# EAGLE schematic All-in-one Starter Kit for Micro：bit V1.0 (EAGLE 9.6.2)
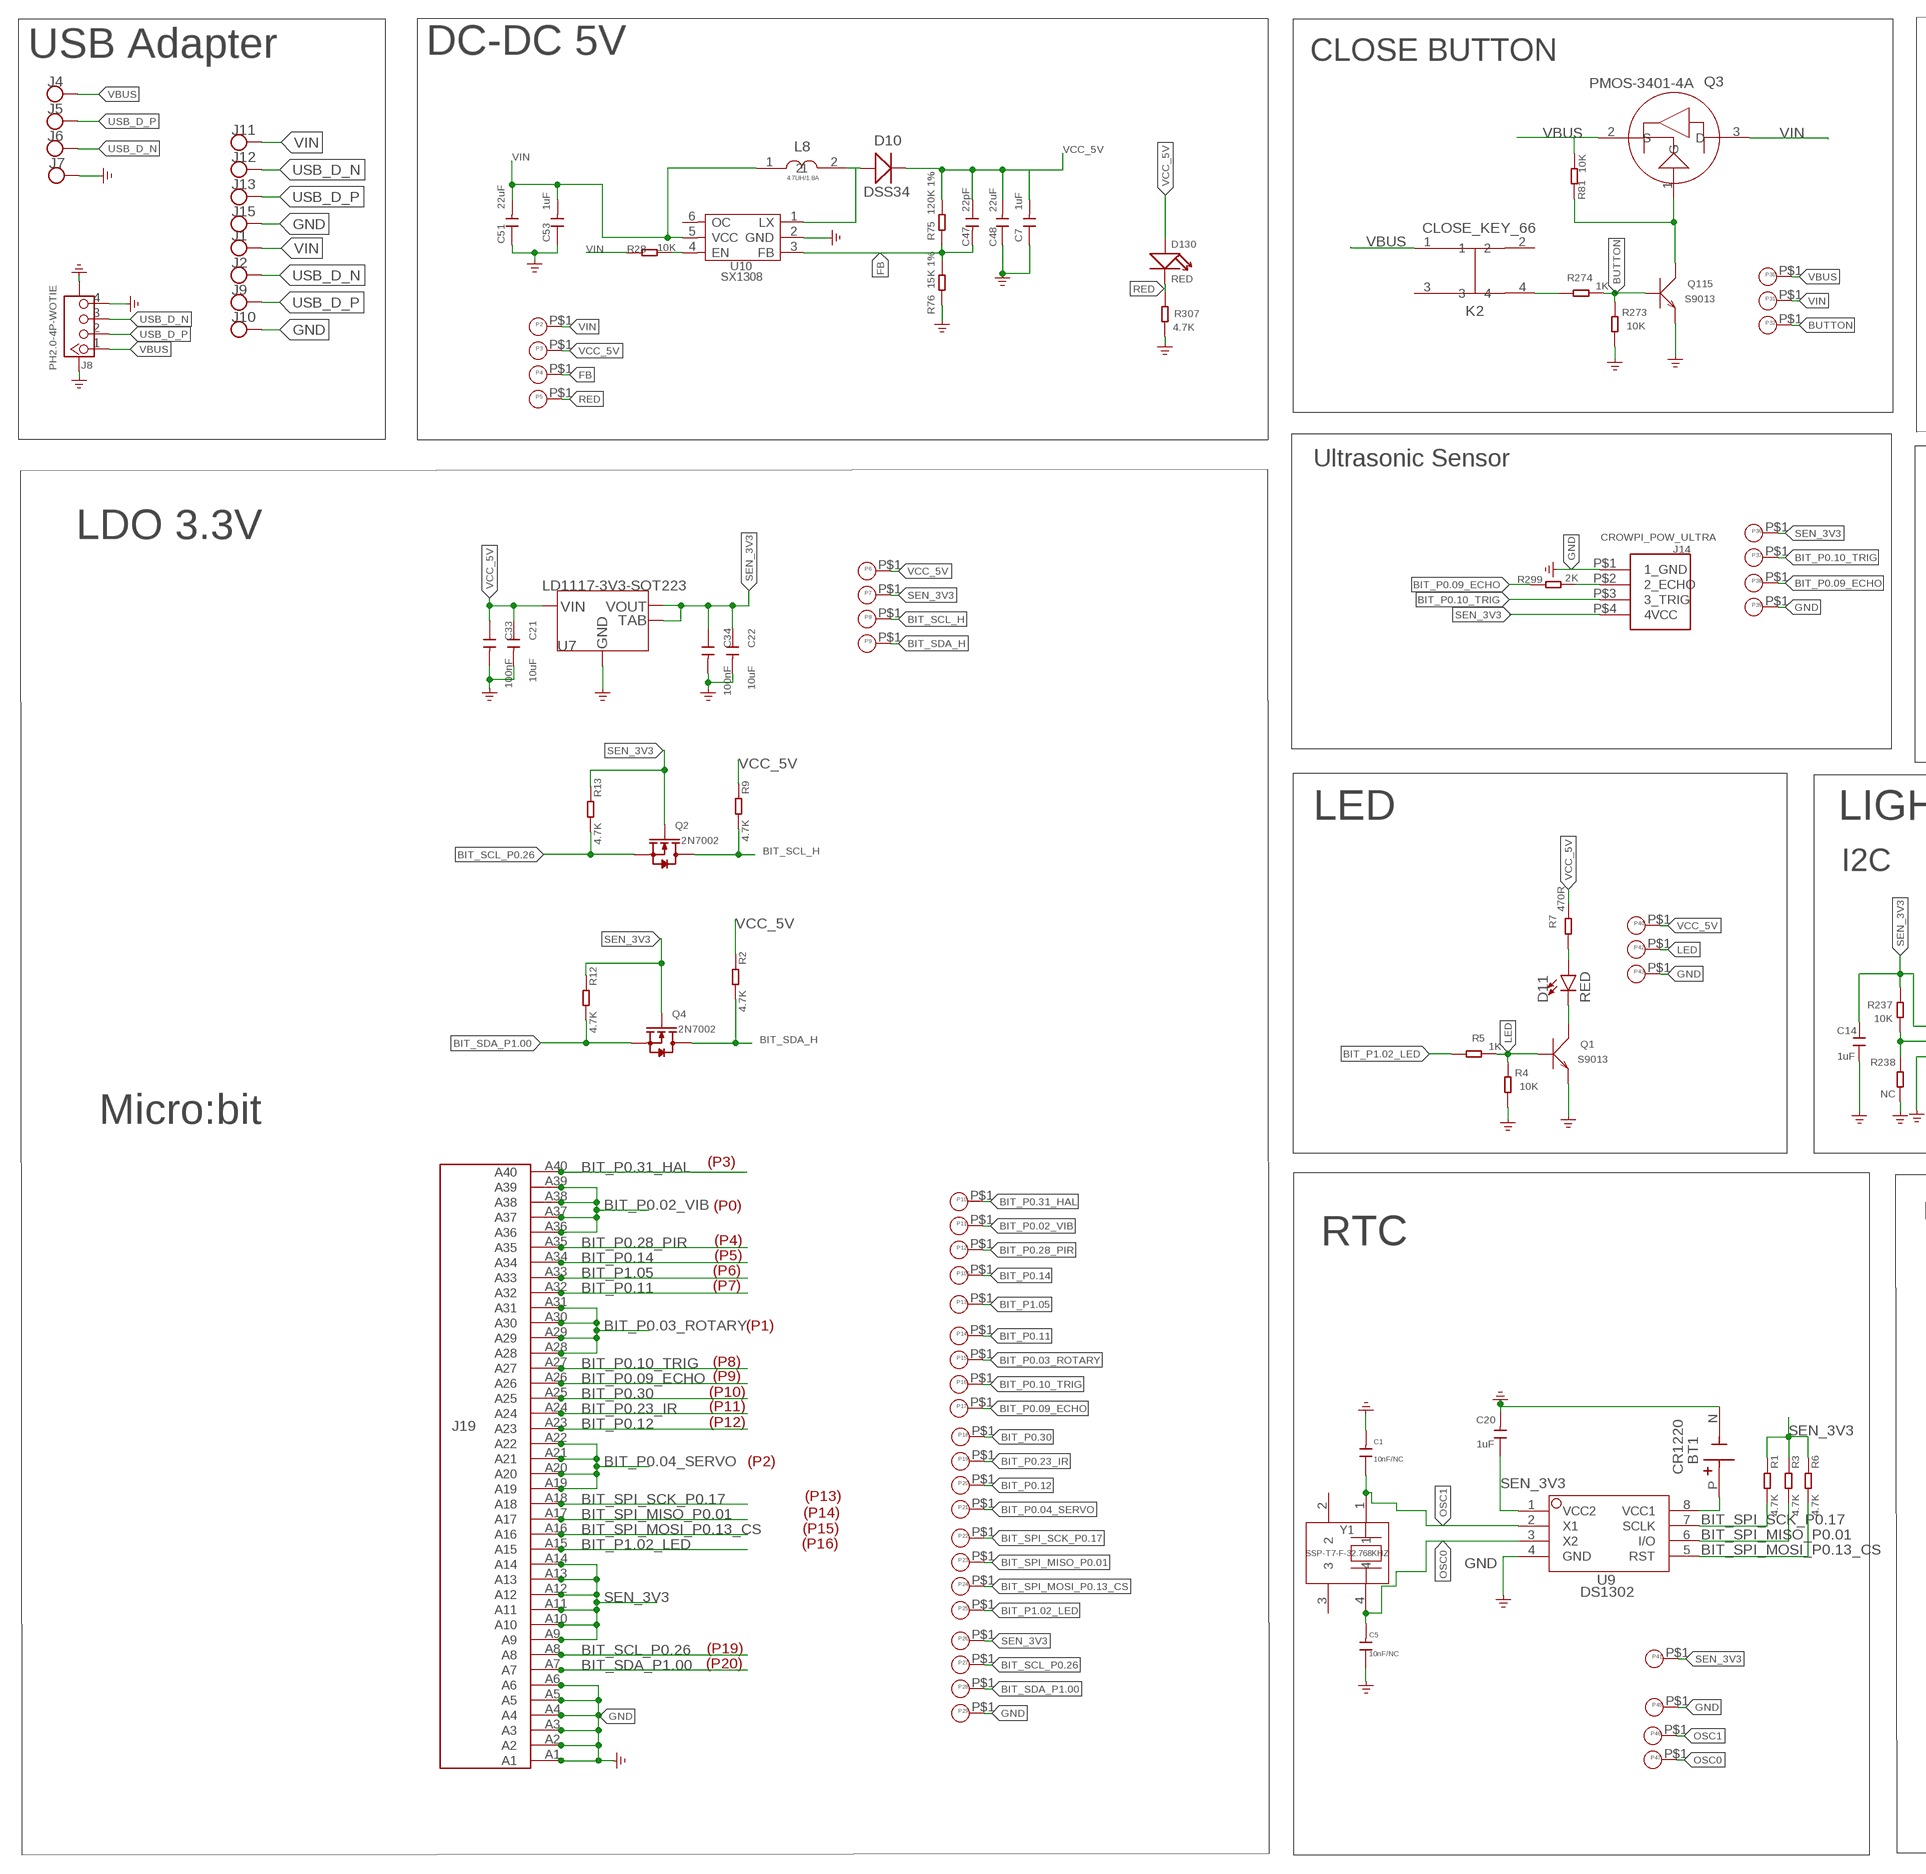
[diagram p0: schematic, sheet 1, part 1 of 2]
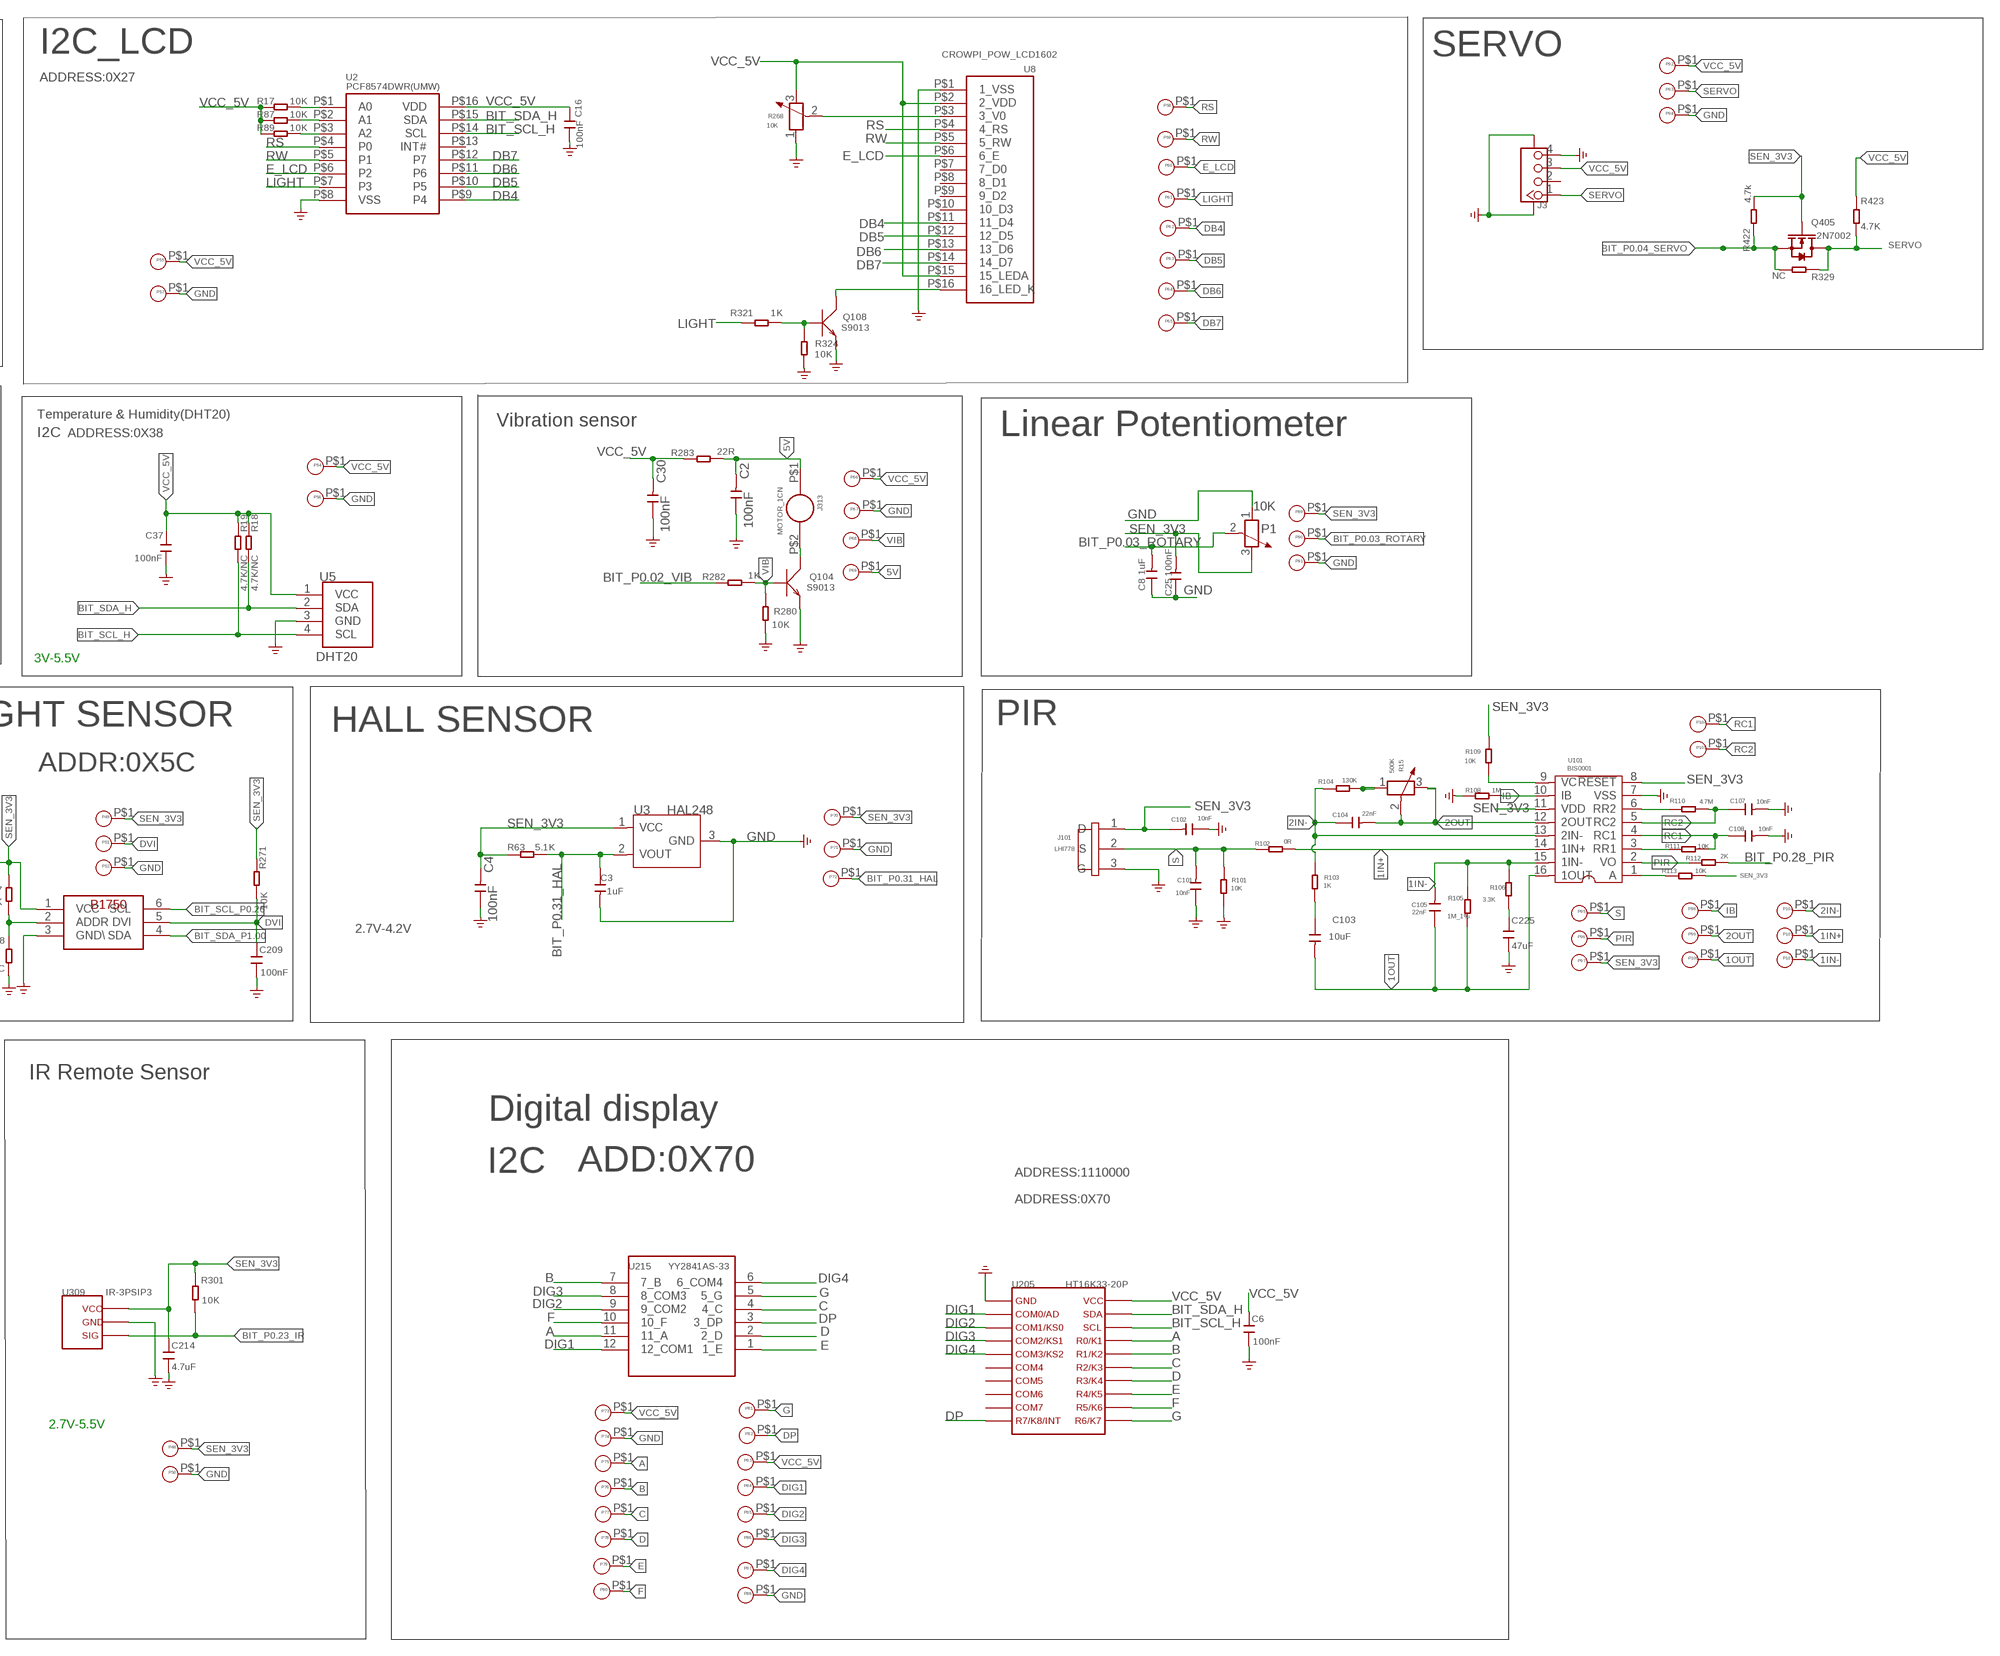
[diagram p1: schematic, sheet 1, part 2 of 2]

## Parts
BT1  CR1220  [CR1220]
C1  10nF/NC  C-0603  [C0603]
C2  100nF  C-0603  [C0603]
C3  1uF  C-0603  [C0603]
C4  100nF  C-0603  [C0603]
C5  10nF/NC  C-0603  [C0603]
C6  100nF  C0603  [0603]
C7  1uF  CAP  [C0603]
C8  1uF  C-0603  [C0603]
C14  1uF  C0603  [0603]
C16  100nF  C0603  [0603]
C20  1uF  CAP  [C0603]
C21  10uF  CAP  [C0603]
C22  10uF  CAP  [C0603]
C25  100nF  C-0603  [C0603]
C30  100nF  C-0603  [C0603]
C33  100nF  CAP  [C0603]
C34  100nF  CAP  [C0603]
C37  100nF  C0603  [0603]
C47  22pF  CAP  [C0603]
C48  22uF  CAPC0805  [C0805]
C51  22uF  CAPC0805  [C0805]
C53  1uF  CAP  [C0603]
C101  10nF  C-0603  [C0603]
C102  10nF  C-0603  [C0603]
C103  10uF  C0603  [0603]
C104  22nF  C-0603  [C0603]
C105  22nF  C-0603  [C0603]
C107  10nF  C-0603  [C0603]
C108  10nF  C-0603  [C0603]
C209  100nF  C0603  [0603]
C214  4.7uF  C0603  [0603]
C225  47uF  C0805  [0805]
D10  DSS34  DIODE  [D_SOD123FL]
D11  RED  LED  [LED-8MM]
D130  RED  LED_0603_SMT  [LED_0603_SMT]
J1  TP-SMDTP-SMD-2X4MM  [TP-SMD-2X4MM]
J2  TP-SMDTP-SMD-2X4MM  [TP-SMD-2X4MM]
J3  A_XBJ_CONNECTOR_TWIG-4P-2.0-SMD-FEMALE-REINFORCE90D  [A_XBJ_CONNECTOR_4P-SMD-2.0-90D]
J4  TP-SMDTP-SMD-2X4MM  [TP-SMD-2X4MM]
J5  TP-SMDTP-SMD-2X4MM  [TP-SMD-2X4MM]
J6  TP-SMDTP-SMD-2X4MM  [TP-SMD-2X4MM]
J7  TP-SMDTP-SMD-2X4MM  [TP-SMD-2X4MM]
J8  PH2.0-4P-WOTIE  [PH2.0-4P]
J9  TP-SMDTP-SMD-2X4MM  [TP-SMD-2X4MM]
J10  TP-SMDTP-SMD-2X4MM  [TP-SMD-2X4MM]
J11  TP-SMDTP-SMD-2X4MM  [TP-SMD-2X4MM]
J12  TP-SMDTP-SMD-2X4MM  [TP-SMD-2X4MM]
J13  TP-SMDTP-SMD-2X4MM  [TP-SMD-2X4MM]
J14  CROWPI_POW_ULTRA  [CROWPI_POW_ULTRA]
J15  TP-SMDTP-SMD-2X4MM  [TP-SMD-2X4MM]
J19  MICROBIT_SMD_40P  [MICROBIT_SMD_40P]
J101  LHI778  [3P-D8.1MM]
J313  MOTOR_1CN  [MOTOR_1CM]
K2  CLOSE_KEY_66  [CLOSE_KEY_6*6]
L8  4.7UH/1.8A  ZEMS252012-4R7M  [1008]
P1  10K  R-POTENTIOMETER  [3P-SQUA-45.6X10X5.8H]
P2  PADPAD-1.0MM  [PAD-1.0MM]
P3  PADPAD-1.0MM  [PAD-1.0MM]
P4  PADPAD-1.0MM  [PAD-1.0MM]
P5  PADPAD-1.0MM  [PAD-1.0MM]
P6  PADPAD-1.0MM  [PAD-1.0MM]
P7  PADPAD-1.0MM  [PAD-1.0MM]
P8  PADPAD-1.0MM  [PAD-1.0MM]
P9  PADPAD-1.0MM  [PAD-1.0MM]
P10  PADPAD-1.0MM  [PAD-1.0MM]
P11  PADPAD-1.0MM  [PAD-1.0MM]
P12  PADPAD-1.0MM  [PAD-1.0MM]
P13  PADPAD-1.0MM  [PAD-1.0MM]
P14  PADPAD-1.0MM  [PAD-1.0MM]
P15  PADPAD-1.0MM  [PAD-1.0MM]
P16  PADPAD-1.0MM  [PAD-1.0MM]
P17  PADPAD-1.0MM  [PAD-1.0MM]
P18  PADPAD-1.0MM  [PAD-1.0MM]
P19  PADPAD-1.0MM  [PAD-1.0MM]
P20  PADPAD-1.0MM  [PAD-1.0MM]
P21  PADPAD-1.0MM  [PAD-1.0MM]
P22  PADPAD-1.0MM  [PAD-1.0MM]
P23  PADPAD-1.0MM  [PAD-1.0MM]
P24  PADPAD-1.0MM  [PAD-1.0MM]
P25  PADPAD-1.0MM  [PAD-1.0MM]
P26  PADPAD-1.0MM  [PAD-1.0MM]
P27  PADPAD-1.0MM  [PAD-1.0MM]
P28  PADPAD-1.0MM  [PAD-1.0MM]
P29  PADPAD-1.0MM  [PAD-1.0MM]
P30  PADPAD-1.0MM  [PAD-1.0MM]
P31  PADPAD-1.0MM  [PAD-1.0MM]
P32  PADPAD-1.0MM  [PAD-1.0MM]
P36  PADPAD-1.0MM  [PAD-1.0MM]
P37  PADPAD-1.0MM  [PAD-1.0MM]
P38  PADPAD-1.0MM  [PAD-1.0MM]
P39  PADPAD-1.0MM  [PAD-1.0MM]
P40  PADPAD-1.0MM  [PAD-1.0MM]
P41  PADPAD-1.0MM  [PAD-1.0MM]
P42  PADPAD-1.0MM  [PAD-1.0MM]
P43  PADPAD-1.0MM  [PAD-1.0MM]
P45  PADPAD-1.0MM  [PAD-1.0MM]
P46  PADPAD-1.0MM  [PAD-1.0MM]
P47  PADPAD-1.0MM  [PAD-1.0MM]
P48  PADPAD-1.0MM  [PAD-1.0MM]
P49  PADPAD-1.0MM  [PAD-1.0MM]
P50  PADPAD-1.0MM  [PAD-1.0MM]
P51  PADPAD-1.0MM  [PAD-1.0MM]
P52  PADPAD-1.0MM  [PAD-1.0MM]
P54  PADPAD-1.0MM  [PAD-1.0MM]
P55  PADPAD-1.0MM  [PAD-1.0MM]
P56  PADPAD-1.0MM  [PAD-1.0MM]
P57  PADPAD-1.0MM  [PAD-1.0MM]
P58  PADPAD-1.0MM  [PAD-1.0MM]
P59  PADPAD-1.0MM  [PAD-1.0MM]
P60  PADPAD-1.0MM  [PAD-1.0MM]
P61  PADPAD-1.0MM  [PAD-1.0MM]
P62  PADPAD-1.0MM  [PAD-1.0MM]
P63  PADPAD-1.0MM  [PAD-1.0MM]
P64  PADPAD-1.0MM  [PAD-1.0MM]
P65  PADPAD-1.0MM  [PAD-1.0MM]
P66  PADPAD-1.0MM  [PAD-1.0MM]
P67  PADPAD-1.0MM  [PAD-1.0MM]
P68  PADPAD-1.0MM  [PAD-1.0MM]
P69  PADPAD-1.0MM  [PAD-1.0MM]
P70  PADPAD-1.0MM  [PAD-1.0MM]
P71  PADPAD-1.0MM  [PAD-1.0MM]
P72  PADPAD-1.0MM  [PAD-1.0MM]
P73  PADPAD-1.0MM  [PAD-1.0MM]
P74  PADPAD-1.0MM  [PAD-1.0MM]
P75  PADPAD-1.0MM  [PAD-1.0MM]
P76  PADPAD-1.0MM  [PAD-1.0MM]
P77  PADPAD-1.0MM  [PAD-1.0MM]
P78  PADPAD-1.0MM  [PAD-1.0MM]
P79  PADPAD-1.0MM  [PAD-1.0MM]
P80  PADPAD-1.0MM  [PAD-1.0MM]
P81  PADPAD-1.0MM  [PAD-1.0MM]
P82  PADPAD-1.0MM  [PAD-1.0MM]
P83  PADPAD-1.0MM  [PAD-1.0MM]
P84  PADPAD-1.0MM  [PAD-1.0MM]
P85  PADPAD-1.0MM  [PAD-1.0MM]
P86  PADPAD-1.0MM  [PAD-1.0MM]
P87  PADPAD-1.0MM  [PAD-1.0MM]
P88  PADPAD-1.0MM  [PAD-1.0MM]
P89  PADPAD-1.0MM  [PAD-1.0MM]
P90  PADPAD-1.0MM  [PAD-1.0MM]
P91  PADPAD-1.0MM  [PAD-1.0MM]
P92  PADPAD-1.0MM  [PAD-1.0MM]
P93  PADPAD-1.0MM  [PAD-1.0MM]
P94  PADPAD-1.0MM  [PAD-1.0MM]
P95  PADPAD-1.0MM  [PAD-1.0MM]
P96  PADPAD-1.0MM  [PAD-1.0MM]
P97  PADPAD-1.0MM  [PAD-1.0MM]
P98  PADPAD-1.0MM  [PAD-1.0MM]
P99  PADPAD-1.0MM  [PAD-1.0MM]
P100  PADPAD-1.0MM  [PAD-1.0MM]
P101  PADPAD-1.0MM  [PAD-1.0MM]
P102  PADPAD-1.0MM  [PAD-1.0MM]
P103  PADPAD-1.0MM  [PAD-1.0MM]
P104  PADPAD-1.0MM  [PAD-1.0MM]
P105  PADPAD-1.0MM  [PAD-1.0MM]
P106  PADPAD-1.0MM  [PAD-1.0MM]
Q1  S9013  TRANSISTOR-NPN-SOT23  [SOT23@1]
Q2  2N7002  MOSFET-N'SOT23'  [SOT23]
Q3  PMOS-3401-4A  DFN8_P-MOS-SOT23  [DFN8_SOT-23]
Q4  2N7002  MOSFET-N'SOT23'  [SOT23]
Q104  S9013  TRANSISTOR-NPN-SOT23  [SOT23@1]
Q108  S9013  TRANSISTOR-NPN-SOT23  [SOT23@1]
Q115  S9013  TRANSISTOR-NPN-SOT23  [SOT23@1]
Q405  2N7002  MOSFET-N'SOT23'  [SOT23]
R1  4.7K  R0603  [R0603]
R2  4.7K  R0603  [R0603]
R3  4.7K  R0603  [R0603]
R4  10K  R-0603  [R0603]
R5  1K  R-0603  [R0603]
R6  4.7K  R0603  [R0603]
R7  470R  R-0603  [R0603]
R9  4.7K  R0603  [R0603]
R12  4.7K  R0603  [R0603]
R13  4.7K  R0603  [R0603]
R15  500K  R-POTENTIOMETER-SMD  [3P-SMD-SQUA-3.6X3.3]
R17  10K  R0603  [R0603]
R18  4.7K/NC  R0603  [R0603]
R19  4.7K/NC  R0603  [R0603]
R28  10K  RES-0603  [R0603-SP]
R63  5.1K  R-0603  [R0603]
R75  120K 1%  RES-0603  [R0603-SP]
R76  15K 1%  RES-0603  [R0603-SP]
R81  10K  DISCRETE_R-0603  [DISCRETE_R0603]
R87  10K  R0603  [R0603]
R89  10K  R0603  [R0603]
R101  10K  R-0603  [R0603]
R102  0R  R-0603  [R0603]
R103  1K  R-0603  [R0603]
R104  130K  R-0603  [R0603]
R105  1M_1%  R-0603  [R0603]
R106  3.3K  R-0603  [R0603]
R108  1M  R-0603  [R0603]
R109  10K  R-0603  [R0603]
R110  4.7M  R-0603  [R0603]
R111  10K  R-0603  [R0603]
R112  2K  R-0603  [R0603]
R113  10K  R-0603  [R0603]
R237  10K  R0603  [R0603]
R238  NC  R0603  [R0603]
R268  10K  R-POTENTIOMETER-SMD  [3P-SMD-SQUA-3.6X3.3]
R271  10K  R0603  [R0603]
R273  10K  R-0603  [R0603]
R274  1K  R-0603  [R0603]
R280  10K  R0603  [R0603]
R282  1K  R0603  [R0603]
R283  22R  R0603  [R0603]
R299  2K  R0603  [R0603]
R301  10K  R0603  [R0603]
R307  4.7K  R0603  [R0603]
R321  1K  R0603  [R0603]
R324  10K  R0603  [R0603]
R329  NC  RESR0603  [R0603]
R422  4.7k  RESR0603  [R0603]
R423  4.7K  RESR0603  [R0603]
U1  BH1750  [BH1750-WSOF-6]
U2  PCF8574DWR(UMW)  PCF8574T/TR  [SO-16-300MIL]
U3  HAL248  A1101  [SOT-23W]
U5  DHT20  CROWTAIL-DHT20-V1.0-20211013_DHT20  [CROWTAIL-DHT20-V1.0-20211013_DHT20]
U7  LD1117-3V3-SOT223  [SOT223]
U8  CROWPI_POW_LCD1602  [CROWPI_POW_LCD1206]
U9  DS1302  [SOP8]
U10  SX1308  STUDY_SX1301  [SOT23-6L]
U101  BIS0001  TM2291  [SOP16]
U205  HT16K33-20P  [HT16K33-SOP20]
U215  YY2841AS-33  4-DIGITAL_DISPLAY  [4-DIGITAL_DISPLAY]
U309  IR-3PSIP3  [VS1838B-SIP3]
Y1  SSP-T7-F-32.768KHZ  [MC-146]

## Nets
1IN+: P102.P$1 R102.1 U101.14(1IN+)
1IN-: C105.2 P103.P$1 R105.2 R106.2 U101.15(1IN-)
1OUT: C103.2 C105.1 P100.P$1 R105.1 U101.16(1OUT)
2IN-: C104.1 P101.P$1 R103.2 R104.2 U101.13(2IN-)
2OUT: C104.2 P99.P$1 R15.2 R15.3 U101.12(2OUT)
5V: C2.2 J313.P$1 P69.P$1 R283.2
A: P75.P$1 U205.P$17 U215.11(11_A)
B: P76.P$1 U205.P$16 U215.7(7_B)
BIT_P0.02_VIB: J19.A36 J19.A37 J19.A38 J19.A39 P11.P$1 R282.1
BIT_P0.03_ROTARY: C8.2 J19.A28 J19.A29 J19.A30 J19.A31 P1.2 P15.P$1 P90.P$1
BIT_P0.04_SERVO: J19.A19 J19.A20 J19.A21 J19.A22 P21.P$1 Q405.2(S) R329.2 R422.1
BIT_P0.09_ECHO: J19.A26 P17.P$1 P38.P$1 R299.2
BIT_P0.10_TRIG: J14.P$3(3_TRIG) J19.A27 P16.P$1 P37.P$1
BIT_P0.11: J19.A32 P14.P$1
BIT_P0.12: J19.A23 P20.P$1
BIT_P0.14: J19.A34 P106.P$1
BIT_P0.23_IR: J19.A24 P19.P$1 R301.2 U309.3
BIT_P0.28_PIR: J19.A35 P12.P$1 R112.1
BIT_P0.30: J19.A25 P18.P$1
BIT_P0.31_HAL: C3.1 J19.A40 P10.P$1 P72.P$1 R63.1 U3.2(VOUT)
BIT_P1.02_LED: J19.A15 P25.P$1 R5.2
BIT_P1.05: J19.A33 P13.P$1
BIT_SCL_H: P8.P$1 Q2.3(D) R9.2 R19.2 U2.P$14(SCL) U5.4(SCL) U205.P$18
BIT_SCL_P0.26: J19.A8 P27.P$1 Q2.2(S) R13.2 U1.6(SCL)
BIT_SDA_H: P9.P$1 Q4.3(D) R2.2 R18.2 U2.P$15(SDA) U5.2(SDA) U205.P$19
BIT_SDA_P1.00: J19.A7 P28.P$1 Q4.2(S) R12.2 U1.4(SDA)
BIT_SPI_MISO_P0.01: J19.A17 P23.P$1 R3.2 U9.6(I/O)
BIT_SPI_MOSI_P0.13_CS: J19.A16 P24.P$1 R6.2 U9.5(RST)
BIT_SPI_SCK_P0.17: J19.A18 P22.P$1 R1.2 U9.7(SCLK)
BUTTON: P32.P$1 Q115.1(B) R273.2 R274.1
C: P77.P$1 U205.P$15 U215.4(4_C)
D: P78.P$1 U205.P$14 U215.2(2_D)
DB4: P62.P$1 U2.P$9(P4) U8.P$11(11_D4)
DB5: P63.P$1 U2.P$10(P5) U8.P$12(12_D5)
DB6: P64.P$1 U2.P$11(P6) U8.P$13(13_D6)
DB7: P65.P$1 U2.P$12(P7) U8.P$14(14_D7)
DIG1: P84.P$1 U205.P$2 U215.12(12_COM1)
DIG2: P85.P$1 U205.P$3 U215.9(9_COM2)
DIG3: P86.P$1 U205.P$4 U215.8(8_COM3)
DIG4: P87.P$1 U205.P$5 U215.6(6_COM4)
DP: P82.P$1 U205.P$10 U215.3(3_DP)
DVI: C209.2 P51.P$1 R271.2 U1.5(DVI)
E: P79.P$1 U205.P$13 U215.1(1_E)
E_LCD: P60.P$1 U2.P$6(P2) U8.P$6(6_E)
F: P80.P$1 U205.P$12 U215.10(10_F)
FB: C47.2 P4.P$1 R75.1 R76.2 U10.3(FB)
G: P81.P$1 U205.P$11 U215.5(5_G)
GND: BT1.N(-) C1.2 C2.1 C3.2 C4.1 C5.1 C6.1 C7.1 C8.1 C14.1 C16.1 C20.2 C21.2 C22.2 C25.1 C30.1 C33.2 C34.2 C37.1 C48.1 C51.1 C53.1 C101.1 C102.1 C107.2 C108.2 C209.1 C214.1 C225.1 J3.4 J3.SS1 J3.SS2 J7.1 J8.4 J8.5(SS1) J8.6(SS2) J10.1 J14.P$1(1_GND) J15.1 J19.A1 J19.A2 J19.A3 J19.A4 J19.A5 J19.A6 J101.3(G) P1.1 P29.P$1 P39.P$1 P43.P$1 P45.P$1 P50.P$1 P52.P$1 P56.P$1 P57.P$1 P67.P$1 P71.P$1 P74.P$1 P88.P$1 P91.P$1 P94.P$1 Q1.2(E) Q104.2(E) Q108.2(E) Q115.2(E) R4.1 R76.1 R101.1 R108.1 R238.1 R268.1 R273.1 R280.1 R307.2 R324.2 U1.3(GND\) U2.P$8(VSS) U3.3(GND) U5.3(GND) U7.1(GND) U8.P$1(1_VSS) U9.4(GND) U10.2(GND) U101.7(VSS) U205.P$1 U309.2 ; supply symbol labelled POWER-OR-GND-_GND_POWER
IB: P98.P$1 R108.2 U101.10(IB)
LED: P42.P$1 Q1.1(B) R4.2 R5.1
LIGHT: P61.P$1 R321.2 U2.P$7(P3)
N$1: R111.1 U101.3(RR1)
N$2: Q108.1(B) R321.1 R324.1
N$3: C225.2 R106.1
N$4: D10.+ L8.2 U10.1(LX)
N$5: Q3.1(G) Q115.3(C) R81.1
N$6: R28.2 U10.4(EN)
N$7: R268.2 U8.P$3(3_V0)
N$8: K2.4 R274.2
N$9: BT1.P(+) U9.8(VCC1)
N$10: R17.2 U2.P$1(A0)
N$11: R87.2 U2.P$2(A1)
N$12: R89.2 U2.P$3(A2)
N$15: D11.2(C) Q1.3(C)
N$16: D11.1(A) R7.2
N$20: Q108.3(C) U8.P$16(16_LED_K)
N$25: R110.2 U101.6(RR2)
N$29: R109.2 U101.9(VC)
N$35: C103.1 R103.1
N$37: R113.2 U101.1(A)
N$39: R15.1 R104.1
N$48: J313.P$2 Q104.3(C)
N$258: R237.1 R238.2 U1.2(ADDR)
N$278: J14.P$2(2_ECHO) R299.1
OSC0: C5.2 P47.P$1 U9.3(X2) Y1.4
OSC1: C1.1 P46.P$1 U9.2(X1) Y1.1
PIR: P96.P$1 R112.2 U101.2(VO)
RC1: C108.1 P104.P$1 R111.2 U101.4(RC1)
RC2: C107.1 P105.P$1 R110.1 U101.5(RC2)
RED: D130.2(2_K) P5.P$1 R307.1
RS: P58.P$1 U2.P$4(P0) U8.P$4(4_RS)
RW: P59.P$1 U2.P$5(P1) U8.P$5(5_RW)
S: C101.2 J101.2(S) P95.P$1 R101.2 R102.2
SEN_3V3: C4.2 C14.2 C20.1 C22.1 C25.2 C34.1 C102.2 C214.2 J14.P$4(4VCC) J19.A9 J19.A10 J19.A11 J19.A12 J19.A13 J19.A14 J101.1(D) P1.3 P7.P$1 P26.P$1 P36.P$1 P41.P$1 P48.P$1 P49.P$1 P70.P$1 P89.P$1 P97.P$1 Q2.1(G) Q4.1(G) Q405.1(G) R1.1 R3.1 R6.1 R12.1 R13.1 R63.2 R109.1 R113.1 R237.2 R271.1 R301.1 R422.2 U1.1(VCC) U3.1(VCC) U7.2(VOUT) U7.4(TAB) U9.1(VCC2) U101.8(!RESET) U101.11(VDD) U309.1
SERVO: J3.1 P93.P$1 Q405.3(D) R329.1 R423.2
USB_D_N: J2.1 J6.1 J8.3 J12.1
USB_D_P: J5.1 J8.2 J9.1 J13.1
VBUS: J4.1 J8.1 K2.1 P30.P$1 Q3.2(S) R81.2
VCC_5V: C6.2 C7.2 C16.2 C21.1 C30.2 C33.1 C37.2 C47.1 C48.2 D10.- D130.1(1_A) J3.3 P3.P$1 P6.P$1 P40.P$1 P54.P$1 P55.P$1 P66.P$1 P73.P$1 P83.P$1 P92.P$1 R2.1 R7.1 R9.1 R17.1 R18.1 R19.1 R75.2 R87.1 R89.1 R268.3 R283.1 R423.1 U2.P$16(VDD) U5.1(VCC) U7.3(VIN) U8.P$2(2_VDD) U8.P$15(15_LEDA) U205.P$20
VIB: P68.P$1 Q104.1(B) R280.2 R282.2
VIN: C51.2 C53.2 J1.1 J11.1 L8.1 P2.P$1 P31.P$1 Q3.3(D) R28.1 U10.5(VCC)
Unconnected: J3.2 K2.2 K2.3 U2.P$13(INT#) U8.P$7(7_D0) U8.P$8(8_D1) U8.P$9(9_D2) U8.P$10(10_D3) U10.6(OC) U205.P$6 U205.P$7 U205.P$8 U205.P$9 Y1.2 Y1.3

## Notes on the sheet
- USB Adapter | DC-DC 5V | CLOSE BUTTON | I2C_LCD | SERVO
- ADDRESS:0X27
- Ultrasonic Sensor
- Temperature & Humidity(DHT20)
- Vibration sensor
- I2C | ADDRESS:0X38 | Linear Potentiometer
- LDO 3.3V
- 3V-5.5V
- LED | LIGHT SENSOR | HALL SENSOR | PIR
- I2C | ADDR:0X5C
- 2.7V-4.2V
- Micro:bit
- (P3)
- (P0)
- IR Remote Sensor
- (P4) | RTC
- (P5)
- Digital display
- (P6)
- (P7)
- I2C | ADD:0X70
- (P1) | ADDRESS:1110000
- ADDRESS:0X70
- (P8)
- (P9)
- (P10)
- (P11)
- J19 | (P12)
- (P2)
- (P13)
- (P14)
- (P15)
- (P16)
- 2.7V-5.5V
- (P19)
- (P20)

## Library data of the parts
BT1 = CR1220:CR1220: Coin Cell Smt Horizontal Insul Check availability <https://pricing.snapeda.com/parts/S8411-45R/Harwin/view-part?ref=eda>; AVAILABILITY: In Stock; CHECK_PRICES: https://www.snapeda.com/parts/S8411-45R/Harwin+Inc./view-part/?ref=eda; DESCRIPTION: Coin Cell Battery Retainer, Horizontal SMT, for CR1220 Coin Cell Batteries, Tape & Reeled; MF: Harwin; MP: S8411-45R; PACKAGE: None; PRICE: None; PURCHASE-URL: https://www.snapeda.com/api/url_track_click_mouser/?unipart_id=424412&manufacturer=Harwin&part_name=S8411-45R&search_term=cr1220; SNAPEDA_LINK: https://www.snapeda.com/parts/S8411-45R/Harwin+Inc./view-part/?ref=snap
C1-C5 C8 C25 C30 C101 C102 C104 C105 C107 C108 = Discrete:C*: Ceramic Capacitors
C6 C14 C16 C37 C209 C214 = cooper:C0603
C7 C21 C22 C33 C34 C47 C48 C51 C53 = LoraWAN_Gateway_Mainboard:CAP*
C20 = CrowPanel_Advance_HMI:CAP*
C103 = A_xbj:C0603
C225 = cooper:C0805
D10 = CrowPanel_Advance_HMI:DIODE*
D11 = Crowtail_Starter:LED: LED (Generic) Standard schematic elements and footprints for 5mm, 3mm, 1206, and 0603 sized LEDs. Generic LEDs with no color specified.
D130 = cooper:LED_0603_SMT
J1 J2 J4-J7 J9-J13 J15 = Crowtail_Starter:TP-SMD
J3 = CrowPanel ESP32 Display-4.3-inch-V2.1-20240314:A_XBJ_CONNECTOR_TWIG-4P-2.0-SMD-FEMALE-REINFORCE
J8 = CrowPanel ESP32 Display-4.3-inch-V2.1-20240314:PH2.0-4P-WOTIE
J14 = Crowtail_Starter_V0.2:CROWPI_POW_ULTRA
J19 = MY_LIB:MICROBIT_SMD_40P
J101 = PIR_motion_sensor:LHI778: Pyroelectric Infrared Detectors
J313 = crowpi_pow:MOTOR_1CN
K2 = WGH:CLOSE_KEY_6*6
L8 = WGH:ZEMS252012-4R7M
P1 R15 R268 = Discrete:R-POTENTIOMETER*: Potentiometer
P2-P32 P36-P43 P45-P52 P54-P106 = crowpi_pow:PAD*
Q1 Q104 Q108 Q115 = Discrete:TRANSISTOR-NPN*: NPN audion
Q2 Q4 Q405 = discrete:MOSFET-N: IRLL014: http://www.vishay.com/docs/91319/sihll014.pdf
Q3 = CrowPanel ESP32 Display-4.3-inch-V2.1-20240314:DFN8_P-MOS-SOT23
R1-R3 R6 R9 R12 R13 R17-R19 R87 R89 R237 R238 R271 R280 R282 R283 R299 R301 R307 R321 R324 = cooper:R0603
R4 R5 R7 R63 R101-R106 R108-R113 R273 R274 = Discrete:R*
R28 R75 R76 = LoraWAN_Gateway_Mainboard:RES*
R81 = Crowtail-_LED-V2.0-20190615-01:DISCRETE_R*
R329 R422 R423 = Brian:RES*
U1 = Crowtail_Starter:BH1750
U2 = Brian:PCF8574T/TR
U3 = IC:A1101: Continuous-Time Switch
U5 = Crowtail_Starter:CROWTAIL-DHT20-V1.0-20211013_DHT20
U7 = Lora_Basic_Gateway_ Module:LD1117-3V3-SOT223
U8 = Crowtail_Starter_V0.2:CROWPI_POW_LCD1602
U9 = WGH:DS1302
U10 = CrowPanel_Advance_HMI:STUDY_SX1301
U101 = PIR_motion_sensor:TM2291: Infrared signal processor
U205 = crowpi_pow:HT16K33-20P
U215 = crowpi_pow:4-DIGITAL_DISPLAY
U309 = Crowtail_Starter:IR-3P
Y1 = WGH:SSP-T7-F-32.768KHZ

## Net classes
0 default: width 0.15 mm, drill 0.3 mm
1 PWR: width 0.15 mm, drill 0.25 mm
2 gnd: width 0.15 mm, drill 0.3 mm, clearance 0.152 mm